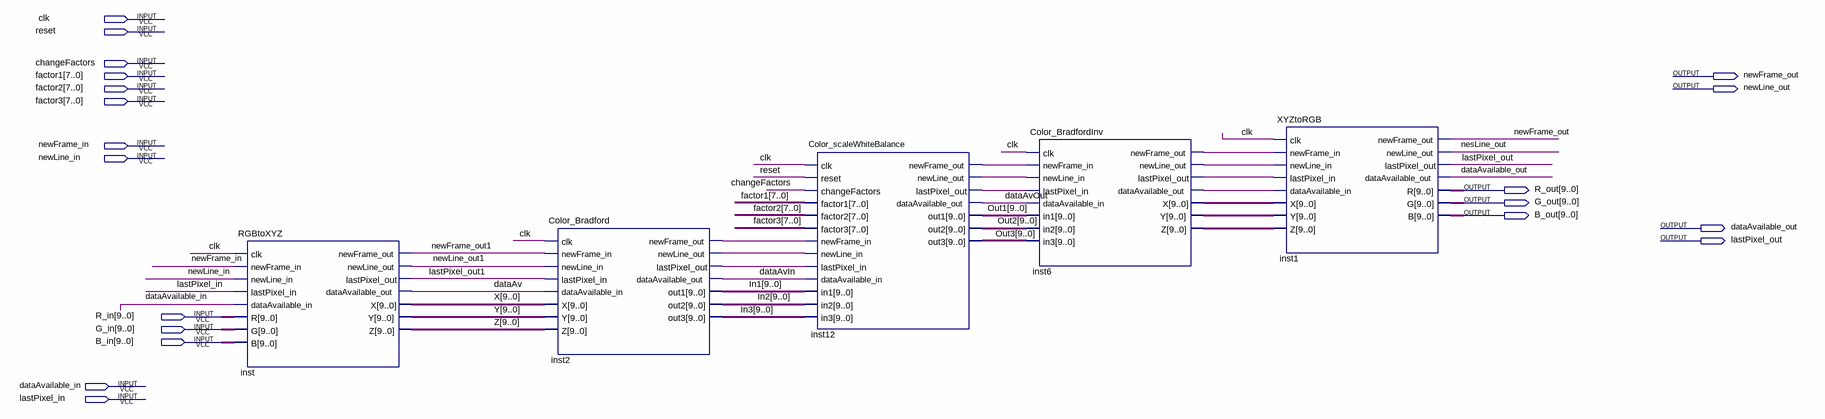
[diagram p0: schematic sheet]
// Quartus schematic WhiteBalance.bdf as structural Verilog: 5 symbols, 20 pins
module WhiteBalance (
  input  clk,
  input  reset,
  input  changeFactors,
  input  [7:0] factor1,
  input  [7:0] factor2,
  input  [7:0] factor3,
  input  newFrame_in,
  input  newLine_in,
  input  [9:0] R_in,
  input  [9:0] G_in,
  input  [9:0] B_in,
  input  dataAvailable_in,
  input  lastPixel_in,
  output newFrame_out,
  output newLine_out,
  output [9:0] R_out,
  output [9:0] G_out,
  output [9:0] B_out,
  output dataAvailable_out,
  output lastPixel_out
);

  wire dataAv, dataAvIn, dataAvOut, inst2_lastpixel_out, inst2_newframe_out, inst2_newline_out,
       inst6_dataavailable_out, inst6_lastpixel_out, inst6_newframe_out, inst6_newline_out,
       inst12_lastpixel_out, inst12_newframe_out, inst12_newline_out, lastPixel_out1, nesLine_out,
       newFrame_out1, newLine_out1;
  wire [9:0] In1, In2, In3, inst6_x, inst6_y, inst6_z, Out1, Out2, Out3, X, Y, Z;

  RGBtoXYZ inst (
    .clk(clk), .newFrame_in(newFrame_in), .newLine_in(newLine_in), .lastPixel_in(lastPixel_in),
    .dataAvailable_in(dataAvailable_in), .R(R_in), .G(G_in), .B(B_in), .newFrame_out(newFrame_out1),
    .newLine_out(newLine_out1), .lastPixel_out(lastPixel_out1), .dataAvailable_out(dataAv), .X(X), .Y(Y),
    .Z(Z));
  Color_Bradford inst2 (
    .clk(clk), .newFrame_in(newFrame_out1), .newLine_in(newLine_out1), .lastPixel_in(lastPixel_out1),
    .dataAvailable_in(dataAv), .X(X), .Y(Y), .Z(Z), .newFrame_out(inst2_newframe_out),
    .newLine_out(inst2_newline_out), .lastPixel_out(inst2_lastpixel_out), .dataAvailable_out(dataAvIn),
    .out1(In1), .out2(In2), .out3(In3));
  Color_scaleWhiteBalance inst12 (
    .clk(clk), .reset(reset), .changeFactors(changeFactors), .factor1(factor1), .factor2(factor2),
    .factor3(factor3), .newFrame_in(inst2_newframe_out), .newLine_in(inst2_newline_out),
    .lastPixel_in(inst2_lastpixel_out), .dataAvailable_in(dataAvIn), .in1(In1), .in2(In2), .in3(In3),
    .newFrame_out(inst12_newframe_out), .newLine_out(inst12_newline_out),
    .lastPixel_out(inst12_lastpixel_out), .dataAvailable_out(dataAvOut), .out1(Out1), .out2(Out2), .out3(Out3));
  Color_BradfordInv inst6 (
    .clk(clk), .newFrame_in(inst12_newframe_out), .newLine_in(inst12_newline_out),
    .lastPixel_in(inst12_lastpixel_out), .dataAvailable_in(dataAvOut), .in1(Out1), .in2(Out2), .in3(Out3),
    .newFrame_out(inst6_newframe_out), .newLine_out(inst6_newline_out), .lastPixel_out(inst6_lastpixel_out),
    .dataAvailable_out(inst6_dataavailable_out), .X(inst6_x), .Y(inst6_y), .Z(inst6_z));
  XYZtoRGB inst1 (
    .clk(clk), .newFrame_in(inst6_newframe_out), .newLine_in(inst6_newline_out),
    .lastPixel_in(inst6_lastpixel_out), .dataAvailable_in(inst6_dataavailable_out), .X(inst6_x), .Y(inst6_y),
    .Z(inst6_z), .newFrame_out(newFrame_out), .newLine_out(nesLine_out), .lastPixel_out(lastPixel_out),
    .dataAvailable_out(dataAvailable_out), .R(R_out), .G(G_out), .B(B_out));
endmodule
